# Altium schematic sheet Display.SchDoc
size A
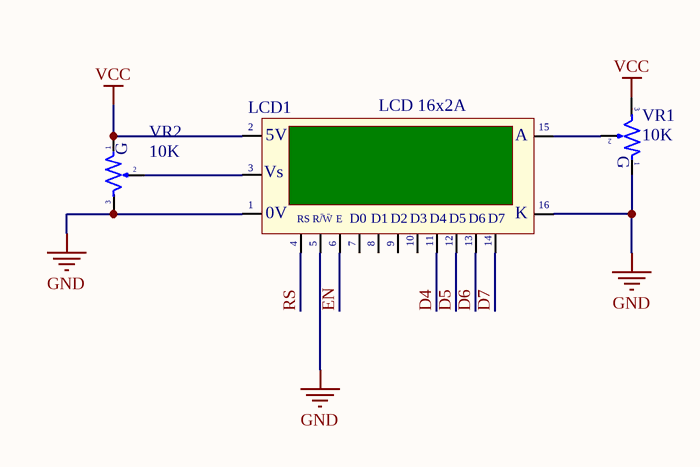
[diagram p0: Display.SchDoc]

## Parts
LCD1  LCD 16x2A  [LCD16X2]
VR1  10K  [VR-S2]
VR2  10K  [VR-S2]

## Nets
GND: LCD1.1(GND) LCD1.5(R/~{W}) LCD1.16(K) VR1.1 VR2.3
VCC: LCD1.2(VDD) VR1.3 VR2.1
D4: LCD1.11(D4)
D5: LCD1.12(D5)
D6: LCD1.13(D6)
D7: LCD1.14(D7)
EN: LCD1.6(~{EN})
RS: LCD1.4(RS)
NetLCD1_3: LCD1.3(VEE) VR2.2
NetLCD1_15: LCD1.15(A) VR1.2

Not connected (* = marked no-connect by the designer): LCD1 7(D0) 8(D1) 9(D2) 10(D3)

## Notes on the sheet
- (in symbol LCD16x2A) 5V; Vs; |; 0V; R/W; E
- (in symbol VR-S) G

## Library data of the parts
LCD1 = LCD16x2A: LCD dipslay 16 char, 2 line; Value: LCD16x2A
VR1 VR2 = VR-S: Var Resistor; Value: Volume 50k